# EAGLE design 3w developer v1 (EAGLE 5.07)
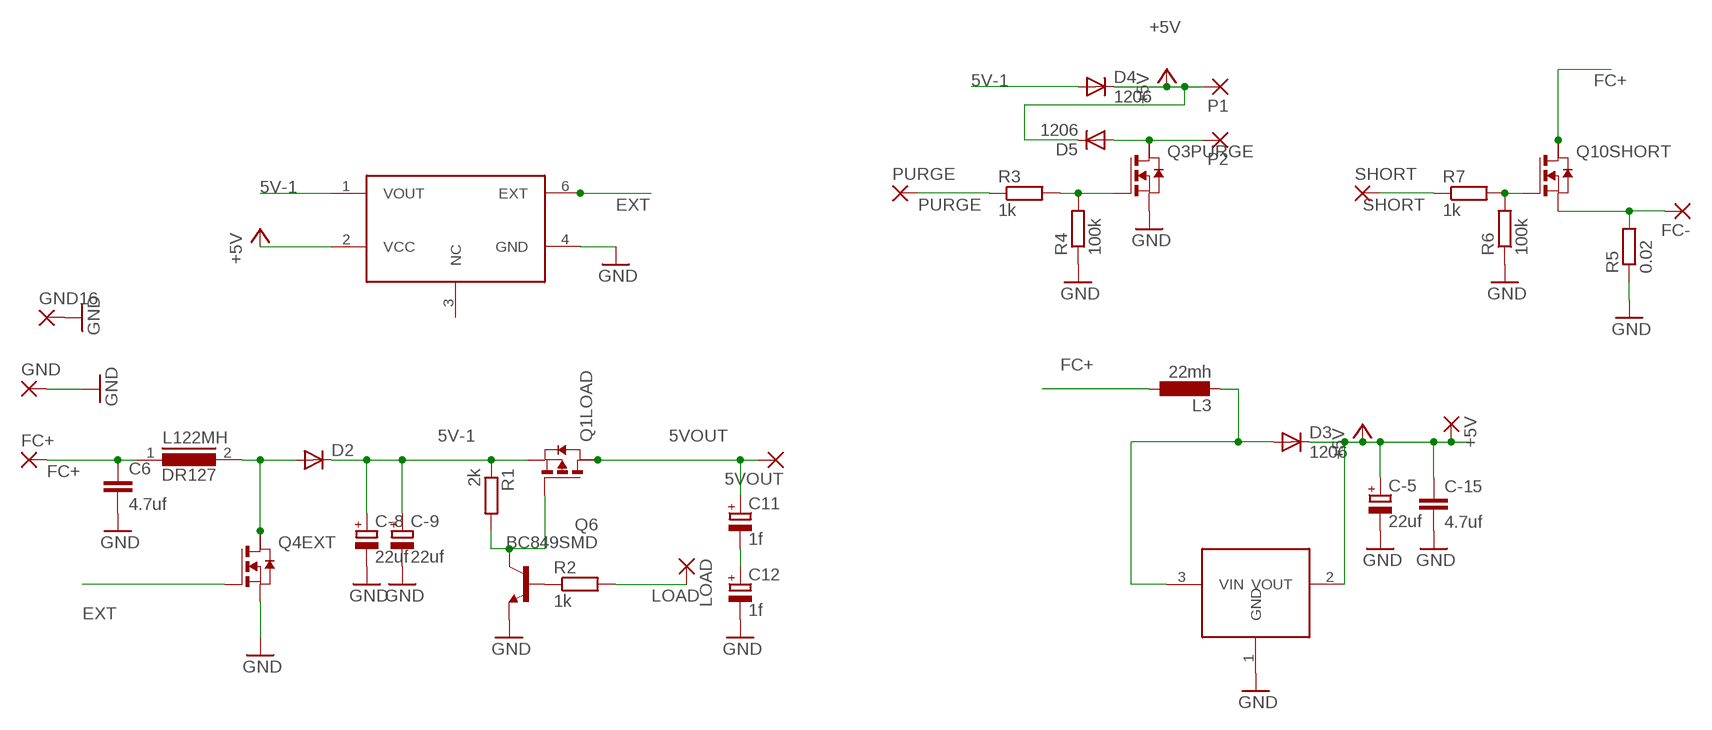
[diagram p0: schematic, sheet 1]

## Parts
5VOUT  2,54/1,1  [2,54/1,1]
+5V  2,54/1,1  [2,54/1,1]
C6  4.7uf  C-EUC1206  [C1206]
C11  1f  CPOL-EUE5-10.5  [E5-10,5]
C12  1f  CPOL-EUE5-10.5  [E5-10,5]
C-5  22uf  CPOL-EUSMCD  [SMC_D]
C-8  22uf  CPOL-EUSMCD  [SMC_D]
C-9  22uf  CPOL-EUSMCD  [SMC_D]
C-15  4.7uf  C-EUC1206  [C1206]
D2  DIODE-DO214AA  [DO214AA]
D3  1206  DIODE-GF1  [GF1]
D4  1206  DIODE-GF1  [GF1]
D5  1206  DIODE-GF1  [GF1]
FC+  2,54/1,1  [2,54/1,1]
FC-  2,54/1,1  [2,54/1,1]
GND  2,54/1,1  [2,54/1,1]
GND16  2,54/1,1  [2,54/1,1]
L3  22mh  L-EUL5650M  [L5650M]
L122MH  DR127  [DR127]
LOAD  2,54/1,1  [2,54/1,1]
P1  2,54/1,1  [2,54/1,1]
P2  2,54/1,1  [2,54/1,1]
PURGE  2,54/1,1  [2,54/1,1]
Q1LOAD  PMOSSOT223  [SOT223]
Q3PURGE  NMOSSOT223  [SOT223]
Q4EXT  NMOSSOT223  [SOT223]
Q6  BC849SMD  [SOT23-BEC]
Q10SHORT  NMOSSOT223  [SOT223]
R1  2k  R-EU_M1206  [M1206]
R2  1k  R-EU_M1206  [M1206]
R3  1k  R-EU_M1206  [M1206]
R4  100k  R-EU_M1206  [M1206]
R5  0.02  R-EU_R6332  [R6332]
R6  100k  R-EU_M1206  [M1206]
R7  1k  R-EU_M1206  [M1206]
SHORT  2,54/1,1  [2,54/1,1]
U$1  MINIPAK-E50  [SOT23-6]
U$2  MINIPAK-7750  [SOT223]

## Nets
5V-1: C-8.+ C-9.+ D2.C D4.A Q1LOAD.3(S) R1.1 U$1.1(VOUT)
5VOUT: 5VOUT.1(P) C11.+ Q1LOAD.2(D)
+5V [medpower]: +5V.1(P) C-5.+ C-15.1 D3.C D4.C D5.C P1.1(P) U$1.2(VCC) U$2.2(VOUT)
EXT: Q4EXT.1(G) U$1.6(EXT)
FC+: C6.1 FC+.1(P) L3.1 L122MH.1 Q10SHORT.2(D)
GND: C6.2 C12.- C-5.- C-8.- C-9.- C-15.2 GND16.1(P) GND.1(P) Q3PURGE.3(S) Q4EXT.3(S) Q6.E R4.1 R5.1 R6.1 U$1.4(GND) U$2.1(GND)
LOAD: LOAD.1(P) R2.2
N$1: Q1LOAD.1(G) Q6.C R1.2
N$2: D5.A P2.1(P) Q3PURGE.2(D)
N$3: D2.A L122MH.2 Q4EXT.2(D)
N$4: Q3PURGE.1(G) R3.2 R4.2
N$5: Q6.B R2.1
N$6: D3.A L3.2 U$2.3(VIN)
N$7: Q10SHORT.1(G) R6.2 R7.2
N$8: C11.- C12.+
OUTPUT: FC-.1(P) Q10SHORT.3(S) R5.2
PURGE: PURGE.1(P) R3.1
SHORT: R7.1 SHORT.1(P)
Unconnected: Q1LOAD.4(D2) Q3PURGE.4(D2) Q4EXT.4(D2) Q10SHORT.4(D2) U$1.3(NC)

## Library data of the parts
5VOUT +5V FC+ FC- GND GND16 LOAD P1 P2 PURGE SHORT = wirepad:2,54/1,1: THROUGH-HOLE PAD
C6 C-15 = matt rcl:C-EU: CAPACITOR, European symbol
C11 C12 C-5 C-8 C-9 = matt rcl:CPOL-EU: POLARIZED CAPACITOR, European symbol
D2-D5 = matt diode:DIODE-: DIODE
L3 = matt rcl:L-EU: INDUCTOR, European symbol
L122MH = inductors:DR127: High Power Density, High Efficiency, Shielded Inductors Source: coiltronics_dr_series.pdf
Q1LOAD = zetex:PMOSSOT223: MOS FET
Q3PURGE Q4EXT Q10SHORT = zetex:NMOSSOT223: MOS FET
Q6 = matt transistor-npn:BC849*: NPN Transistor
R1-R7 = resistor:R-EU_: RESISTOR, European symbol
U$1 = matt:MINIPAK-E50
U$2 = matt:MINIPAK-7750

## Net classes
1 power: width 3 mm
2 medpower: width 1 mm

## Board
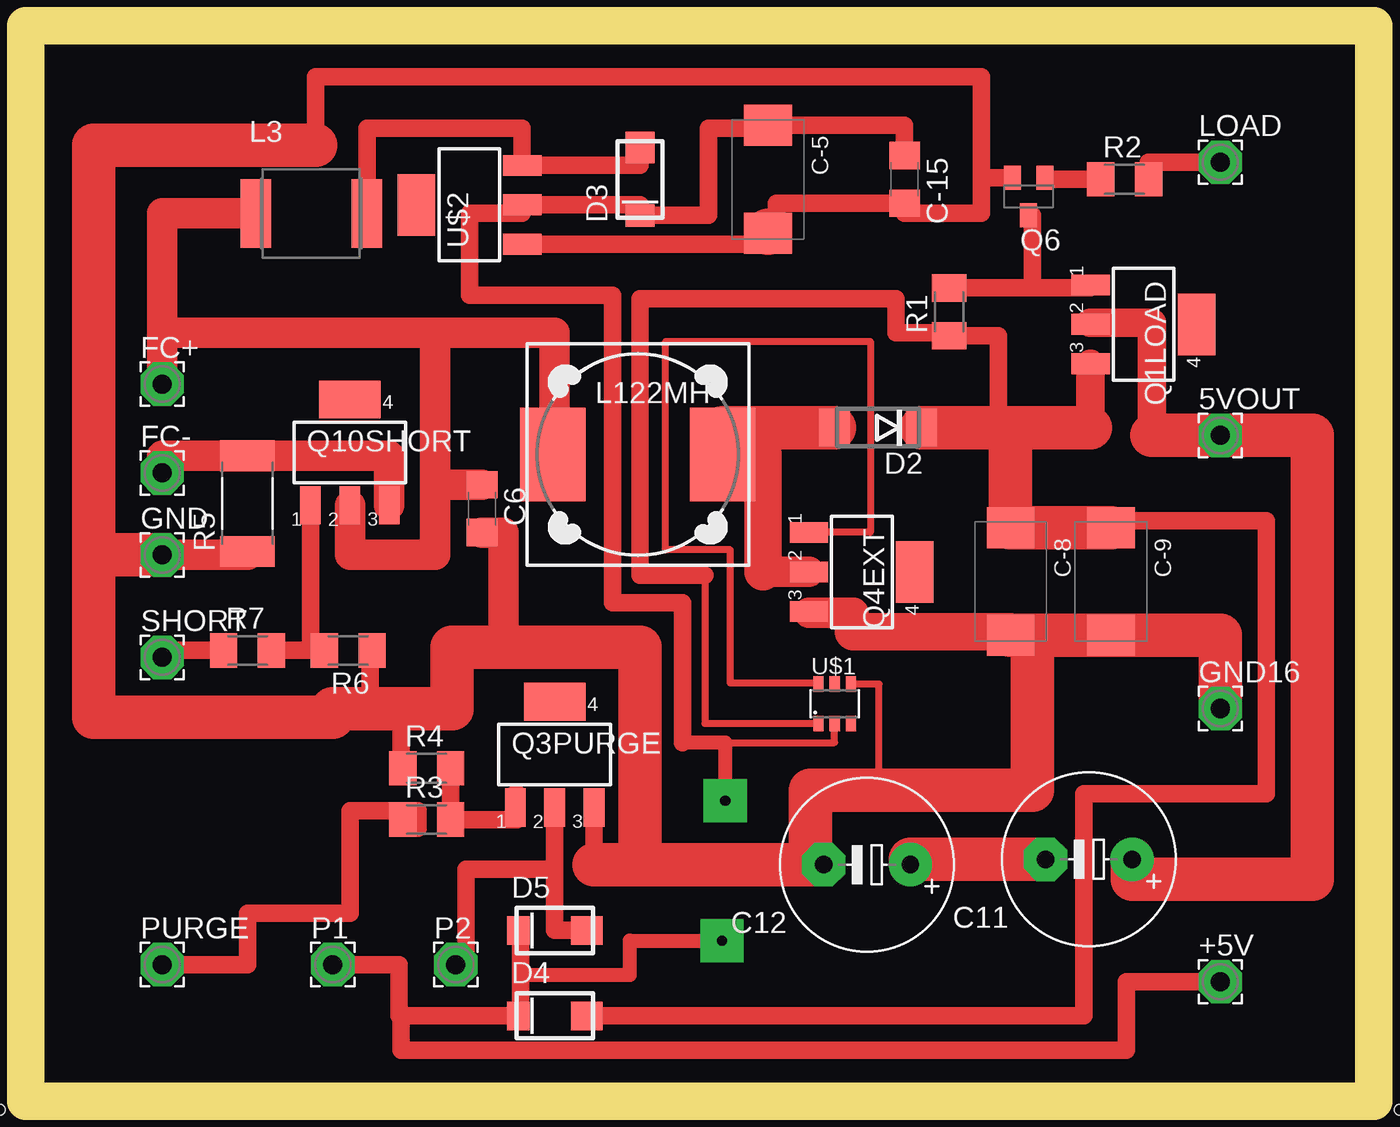
[diagram p1: board, top side]
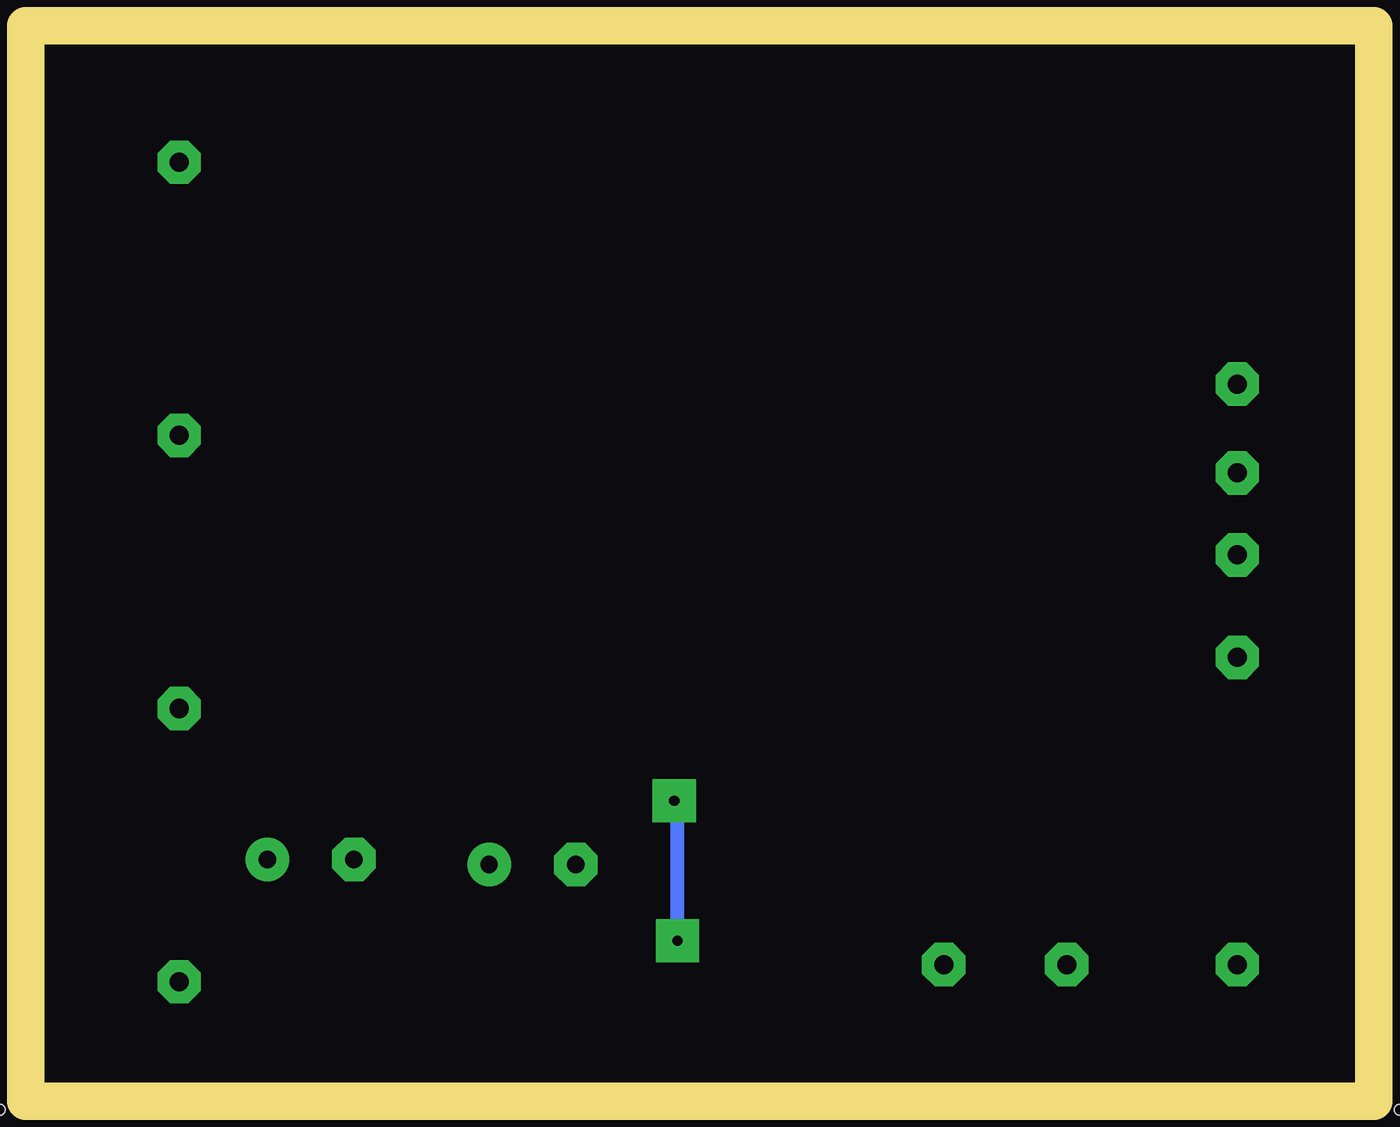
[diagram p2: board, bottom side, seen from below]

Size 77 x 61 mm. Coordinates in mm from the lower left corner, seen from the top.
Outline: 0,0 77,0 77,61 0,61 0,0
Copper layers (1*16): Top 0.035mm / dielectric 1.5mm / Bottom 0.035mm
Design rules "default": minimum track width 10mil, minimum drill 24mil, track to track 8mil, track to pad 8mil, pad to pad 8mil, via to via 8mil, smd to smd 8mil, copper to edge 40mil, drill to drill 8mil, minimum pad ring 10mil, minimum via ring 8mil, stop-mask expansion 4mil, vias tented up to drill 0mil, thermal gap 10mil
Holes 0.6 mm at -2.5,-1.5 79.5,-1.5
Milling: 4 lines

### Footprints (pad centres in the part's own frame; a part is rotated, then mirrored left to right if it is on the bottom)
2,54/1,1 = drill 1.118 pad 2.54 octagon: 1 0,0
C1206 = smd 1.6 x 1.8: 1 -1.4,0; 2 1.4,0
E5-10,5 = drill 1.016 pad 2.54 round: + -2.54,0 | drill 1.016 pad 2.54 octagon: - 2.54,0
SMC_D = smd 2.4 x 2.8: + -3.15,0; - 3.15,0
DO214AA = smd 1.8 x 2.2: A 2.55,0; C -2.55,0
GF1 = smd 1.85 x 1.68: A 1.87,0 | smd 1.32 x 1.68: C -2.12,0
L5650M = smd 1.8 x 4: 1 -2.5,0; 2 4,0
DR127 = smd 3.85 x 5.5: 1 -4.975,0; 2 4.975,0
SOT223 = smd 1.219 x 2.235: 1 -2.311,-3.099; 2 0,-3.099; 3 2.311,-3.099 | smd 3.6 x 2.2: 4 0,3.099
SOT23-BEC = smd 1 x 1.4: B -0.95,-1.1; C 0,1.1; E 0.95,-1.1
M1206 = smd 1.6 x 2: 1 -1.4,0; 2 1.4,0
R6332 = smd 1.8 x 3.2: 1 -2.8,0; 2 2.8,0
SOT23-6 = smd 0.6 x 0.9: 1 -2.22,0.12; 2 -1.27,0.12; 3 -0.32,0.12; 4 -0.32,2.42; 5 -1.27,2.42; 6 -2.22,2.42

### Placement (x,y rotation side)
5VOUT  69,38 0 top
+5V  69,6 0 top
C6  25.74,33.71 270 top
C11  61.3,13.16 180 top
C12  48.3,12.86 180 top
C-5  42.5,53 270 top
C-8  56.71,29.44 270 top
C-9  62.59,29.44 270 top
C-15  50.5,53 270 top
D2  48.94,38.45 180 top
D3  35,53 90 top
D4  30,4 0 top
D5  30,9 0 top
FC+  7,41 0 top
FC-  7,35.8 0 top
GND  7,31 0 top
GND16  69,22 0 top
L3  15,51 0 top
L122MH  34.87,36.88 0 top
LOAD  69,54 0 top
P1  17,7 0 top
P2  24.2,7 0 top
PURGE  7,7 0 top
Q1LOAD  64.5,44.5 270 top
Q3PURGE  30,19.3 0 top
Q4EXT  48,30 270 top
Q6  57.76,52 180 top
Q10SHORT  18,37 0 top
R1  53.11,45.24 90 top
R2  63.39,53 0 top
R3  22.5,15.5 0 top
R4  22.5,18.5 0 top
R5  12,34 90 top
R6  17.9,25.4 180 top
R7  12,25.4 0 top
SHORT  7,25 0 top
U$1  47.68,21.01 0 top
U$2  25,51.5 90 top

### Tracks (layer width: path | path; a pad name or v marks a point on that pad's centre or on a via)
5V-1
  Top 0.406: U$1.1 38.8,21.13 38.8,29.8
  Top 1.016: 56,38.45 56,43.84 R1.1 53.11,44 50,44 50,46 35,46 35,29.8 38.8,29.8 | D4.A 61,4 61,17 71.7,17 71.7,33 62.59,33 C-9.+
  Top 1.676: 61.4,38.45 Q1LOAD.3
  Top 2.54: 56.71,38.45 56,38.45 D2.C | 56.71,38.45 C-8.+ C-9.+ | 56.71,38.45 61.4,38.45
5VOUT
  Top 1.016: 61.4,44.6 Q1LOAD.2
  Top 1.676: 65,38 65,44.6 61.4,44.6
  Top 2.54: C11.+ 63.84,12 74.4,12 74.4,38 5VOUT.1 65,38
+5V  (via drill 0.6 pad 2.54)
  Top 0.406: U$1.2 46.4,20 37.5,20
  Top 0.813: 37.5,20 40,20 v40,16.6 | v39.8,8.4 34.4,8.4 34.4,6.4 28,6.4 28,6.8
  Top 1.016: C-15.1 50.5,56.15 C-5.+ 42.5,56 39,56 39,50.88 D3.C 35,51.5 U$2.2 28.1,51 25,51 25,46.2 33.4,46.2 33.4,28.2 37.5,28.2 37.5,20 | D5.C 28,9 28,6.8 28,4 D4.C 21,4 | 21,4 20.88,4 20.88,7 P1.1 | +5V.1 63.5,6 63.5,2 21,2 21,4
  Bottom 0.813: v40,16.6 39.8,16.6 v39.8,8.4
EXT
  Top 0.406: Q4EXT.1 48.5,32.31 48.5,43.5 36.5,43.5 36.5,31.3 40.3,31.3 40.3,23.5 45.46,23.5 U$1.6
FC+
  Top 1.016: 30,36.88 L122MH.1 | 23,35.11 23,35
  Top 1.778: L3.1 7,51 7,44 | FC+.1 7,44 | 30,36.88 30,44 23,44 | 7,44 23,44 | Q10SHORT.2 18,31 23,31 23,35 | 23,44 23,35.11 C6.1
GND
  Top 0.406: U$1.4 49,23.43 49,18
  Top 1.016: U$2.1 42.5,49.19 C-5.- | 42,50 42.5,50 43,50 43,51.6 C-15.2 50.5,51 55,51 55,53.1 | 32.31,12.86 Q3PURGE.3 | 55,53.1 Q6.E | 44.9,27.6 Q4EXT.3 | 45,17.2 49,18 | 16,55 16,59 55,59 55,53.1 | R4.1 21,18.5 21,22 | 12,31 R5.1 | R6.1 19.2,25.4 19.2,22
  Top 1.676: 47.5,26.5 47.5,27.6 | C-8.- 56.71,26.5
  Top 1.778: GND.1 12,31 | C6.2 27,32.31 27,25.6 | 47.5,27.6 44.9,27.6
  Top 2.184: 56.71,26.5 47.5,26.5
  Top 2.54: 42.5,50 C-5.- | GND16.1 69,26.29 C-9.- C-8.- 58,26.29 58,17.2 45,17.2 45,12.86 C12.- 35,12.86 | 35,12.86 32.31,12.86 | 35,12.86 35,25.6 27,25.6 24,25.6 24,22 21,22 19.2,22 17,22 17,21.5 3,21.5 3,31 | 16,55 3,55 3,31 | 3,31 GND.1
LOAD
  Top 1.016: LOAD.1 64.79,54 R2.2
N$1
  Top 1.016: 61.76,46.81 Q1LOAD.1 61.4,46.64 58,46.64 | R1.2 58,46.64 | Q6.C 58,50.9 58,46.64
N$2
  Top 1.016: 30,12.6 30,9 D5.A | P2.1 24.8,7 24.8,12.6 30,12.6 | 30,12.6 Q3PURGE.2
N$3
  Top 1.016: 42.2,36.88 L122MH.2
  Top 1.778: 42.2,30 Q4EXT.2
  Top 2.184: 42.2,30 42.2,36.88
  Top 2.54: D2.A 39.84,38.45 L122MH.2
N$4
  Top 1.016: R4.2 R3.2 27.8,15.5 27.8,17 27.69,17 Q3PURGE.1
N$5
  Top 1.016: R2.1 58.71,53 Q6.B
N$6
  Top 1.016: L3.2 19,56 28.1,56 U$2.3 35,53.81 D3.A
N$7
  Top 1.016: 15.69,25.4 R6.2 | R7.2 15.69,25.4 | 15.69,25.4 Q10SHORT.1
N$8
  Top 2.54: C11.- 50.84,13.16 C12.+
OUTPUT
  Top 1.016: FC-.1 7,36.8
  Top 1.778: 7,36.8 R5.2 20.31,36.8 Q10SHORT.3
PURGE
  Top 1.016: PURGE.1 12,7 12,10 18,10 18,16 22,16 22,15 21.1,15 R3.1
SHORT
  Top 1.016: R7.1 7,25.4 SHORT.1